# EAGLE design working (EAGLE 5.11)
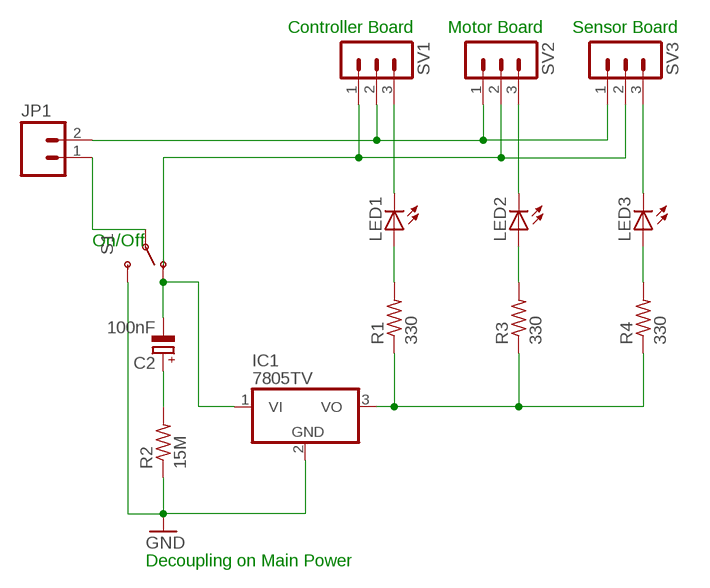
[diagram p0: schematic, sheet 1]

## Parts
C2  100nF  CPOL-EUE1.8-4  [E1,8-4]
IC1  7805TV  [TO220V]
JP1  M023.5MM_LOCK  [SCREWTERMINAL-3.5MM-2_LOCK]
LED1  LED5MM  [LED5MM]
LED2  LED5MM  [LED5MM]
LED3  LED5MM  [LED5MM]
R1  330  R-US_0204/5  [0204/5]
R2  15M  R-US_0204/5  [0204/5]
R3  330  R-US_0204/5  [0204/5]
R4  330  R-US_0204/5  [0204/5]
S1  SWITCH-SPSTPTH_LOCK  [SWITCH-SPDT_LOCK.007S]
SV1  MA03-1  [MA03-1]
SV2  MA03-1  [MA03-1]
SV3  MA03-1  [MA03-1]

## Nets
GND: IC1.2(GND) R2.1 S1.3(S)
N$1: JP1.2 SV1.2 SV2.1 SV3.1
N$2: C2.- IC1.1(VI) S1.1(O)
N$3: LED2.K(C) SV2.3
N$4: JP1.1 S1.2(P)
N$5: LED1.K(C) SV1.3
N$6: LED3.K(C) SV3.3
N$7: SV1.1 SV2.2 SV3.2
N$8: LED3.A R4.2
N$9: LED2.A R3.2
N$10: C2.+ R2.2
N$11: LED1.A R1.2
N$12: IC1.3(VO) R1.1 R3.1 R4.1

## Notes on the sheet
- Controller Board | Motor Board | Sensor Board
- On/Off
- Decoupling on Main Power

## Library data of the parts
C2 = rcl:CPOL-EU: POLARIZED CAPACITOR, European symbol
IC1 = linear:78*: Positive VOLTAGE REGULATOR Source: http://cache.national.com/ds/LM/LM78L05.pdf http://www.fairchildsemi.com/ds/LM/LM7805.pdf
JP1 = SparkFun:M02: Header 2 Standard 2-pin 0.1" header. Use with straight break away headers (SKU : PRT-00116), right angle break away headers (PRT-00553), swiss pins (PRT-00743), machine pins (PRT-00117), and female headers (PRT-00115). Molex polarized connector foot print use with SKU : PRT-08233 with associated crimp pins and housings.
LED1-LED3 = led:LED: LED OSRAM: - CHIPLED LG R971, LG N971, LY N971, LG Q971, LY Q971, LO R971, LY R971 LH N974, LH R974 LS Q976, LO Q976, LY Q976 LO Q996 - Hyper CHIPLED LW Q18S LB Q993, LB Q99A, LB R99A - SideLED LS A670, LO A670, LY A670, LG A670, LP A670 LB A673, LV A673, LT A673, LW A673 LH A674 LY A675 LS A676, LA A676, LO A676, LY A676, LW A676 LS A679, LY A679, LG A679 - Hyper Micro SIDELED® LS Y876, LA Y876, LO Y876, LY Y876 LT Y87S - SmartLED LW L88C, LW L88S LB L89C, LB L89S, LG L890 LS L89K, LO L89K, LY L89K LS L896, LA L896, LO L896, LY L896 - TOPLED LS T670, LO T670, LY T670, LG T670, LP T670 LSG T670, LSP T670, LSY T670, LOP T670, LYG T670 LG T671, LOG T671, LSG T671 LB T673, LV T673, LT T673, LW T673 LH T674 LS T676, LA T676, LO T676, LY T676, LB T676, LH T676, LSB T676, LW T676 LB T67C, LV T67C, LT T67C, LS T67K, LO T67K, LY T67K, LW E67C LS E67B, LA E67B, LO E67B, LY E67B, LB E67C, LV E67C, LT E67C LW T67C LS T679, LY T679, LG T679 LS T770, LO T770, LY T770, LG T770, LP T770 LB T773, LV T773, LT T773, LW T773 LH T774 LS E675, LA E675, LY E675, LS T675 LS T776, LA T776, LO T776, LY T776, LB T776 LHGB T686 LT T68C, LB T68C - Hyper Mini TOPLED® LB M676 - Mini TOPLED Santana® LG M470 LS M47K, LO M47K, LY M47K Source: http://www.osram.convergy.de LUXEON: - LUMILED® LXK2-PW12-R00, LXK2-PW12-S00, LXK2-PW14-U00, LXK2-PW14-V00 LXK2-PM12-R00, LXK2-PM12-S00, LXK2-PM14-U00 LXK2-PE12-Q00, LXK2-PE12-R00, LXK2-PE12-S00, LXK2-PE14-T00, LXK2-PE14-U00 LXK2-PB12-K00, LXK2-PB12-L00, LXK2-PB12-M00, LXK2-PB14-N00, LXK2-PB14-P00, LXK2-PB14-Q00 LXK2-PR12-L00, LXK2-PR12-M00, LXK2-PR14-Q00, LXK2-PR14-R00 LXK2-PD12-Q00, LXK2-PD12-R00, LXK2-PD12-S00 LXK2-PH12-R00, LXK2-PH12-S00 LXK2-PL12-P00, LXK2-PL12-Q00, LXK2-PL12-R00 Source: www.luxeon.com KINGBRIGHT: KA-3528ASYC Source: www.kingbright.com
R1-R4 = resistor:R-US_: RESISTOR, American symbol
S1 = SparkFun:SWITCH-SPST: SPST Switch Simple slide switch. Spark Fun Electronics SKU : COM-00102
SV1-SV3 = con-lstb:MA03-1: PIN HEADER; OC_FARNELL: unknown; OC_NEWARK: unknown

## Board
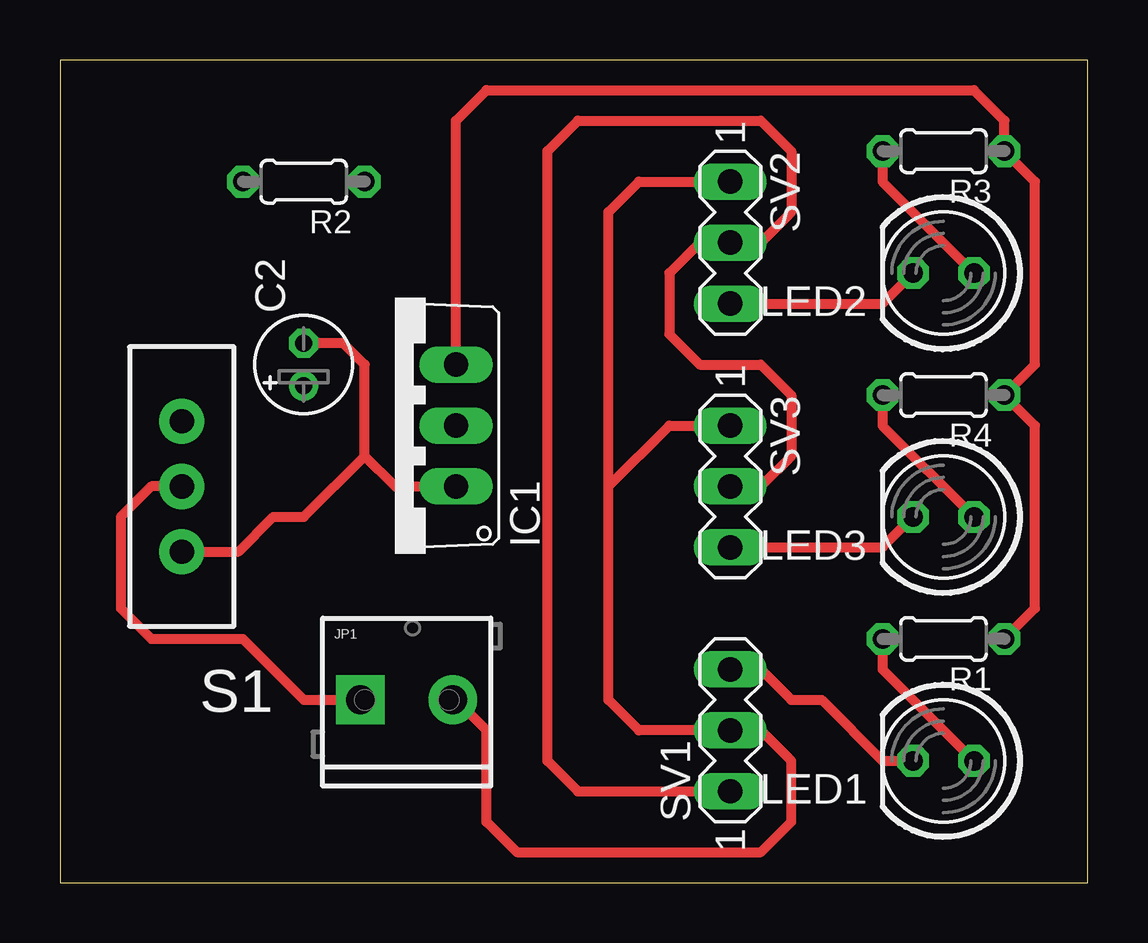
[diagram p1: board, top side]
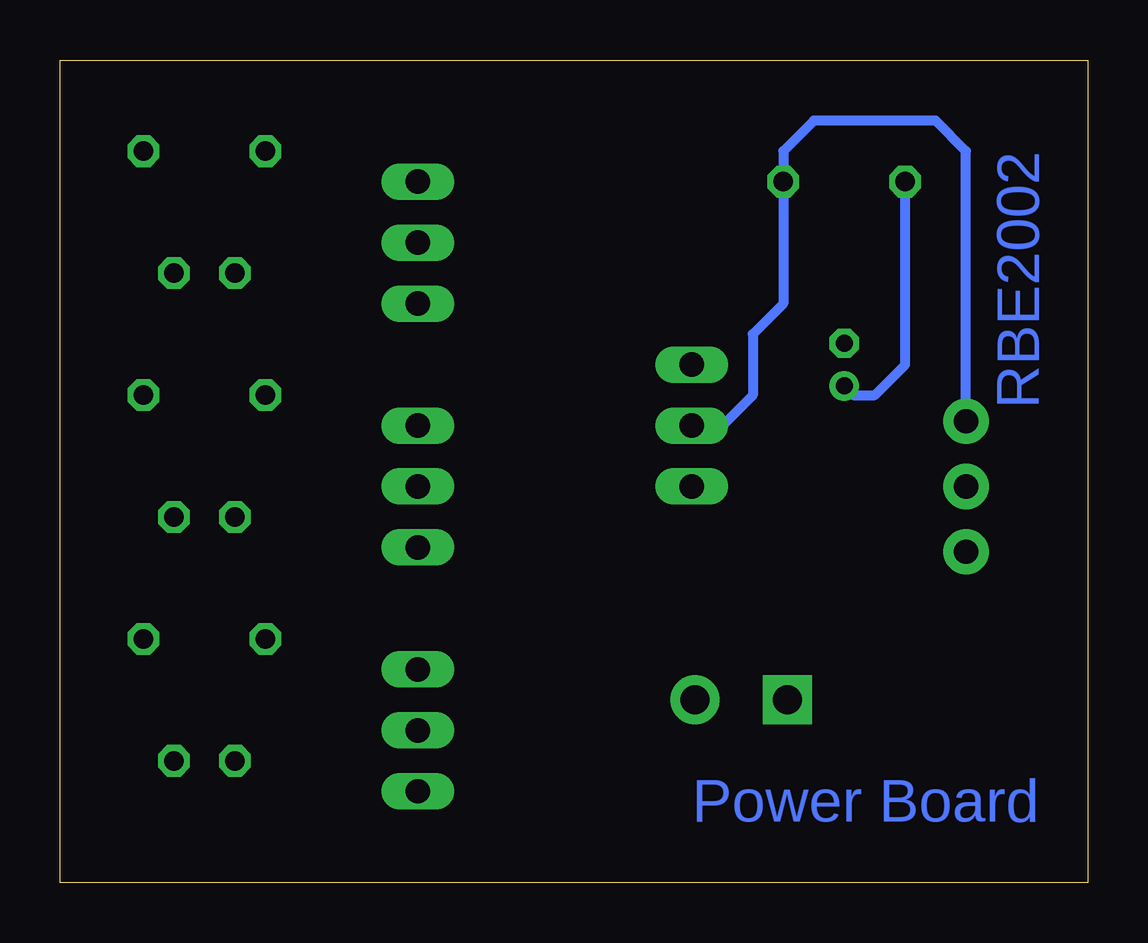
[diagram p2: board, bottom side, seen from below]

Size 42.85 x 34.28 mm. Coordinates in mm from the lower left corner, seen from the top.
Outline: 0,0 42.85,0 42.85,34.28 0,34.28 0,0
Copper layers (1*16): Top 0.035mm / dielectric 1.5mm / Bottom 0.035mm
Design rules "default": minimum track width 10mil, minimum drill 24mil, track to track 8mil, track to pad 8mil, pad to pad 8mil, via to via 8mil, smd to smd 8mil, copper to edge 40mil, drill to drill 8mil, minimum pad ring 10mil, minimum via ring 8mil, stop-mask expansion 4mil, vias tented up to drill 0mil, thermal gap 10mil

### Footprints (pad centres in the part's own frame; a part is rotated, then mirrored left to right if it is on the bottom)
E1,8-4 = drill 0.711 pad 1.168 round: + -0.889,0 | drill 0.711 pad 1.168 octagon: - 0.889,0
TO220V = drill 1.016 long: 1 -2.54,-2.54; 2 0,-2.54; 3 2.54,-2.54
SCREWTERMINAL-3.5MM-2_LOCK = drill 1.2 pad 2.032 square: 1 -0.178,0 | drill 1.2 pad 2.032 round: 2 3.678,0
LED5MM = drill 0.813 octagon: A -1.27,0; K 1.27,0
0204/5 = drill 0.813 octagon: 1 -2.54,0; 2 2.54,0
SWITCH-SPDT_LOCK.007S = drill 1.016 pad 1.88 round: 1 0,2.718; 2 0,0; 3 0,-2.718
MA03-1 = drill 1.016 long: 1 -2.54,0; 2 0,0; 3 2.54,0

### Placement (x,y rotation side)
C2  10.16,21.59 90 top
IC1  13.97,19.05 90 top
JP1  12.7,7.62 0 top
LED1  36.83,5.08 180 top
LED2  36.83,25.4 180 top
LED3  36.83,15.24 180 top
R1  36.83,10.16 180 top
R2  10.16,29.21 180 top
R3  36.83,30.48 180 top
R4  36.83,20.32 180 top
S1  5.08,16.51 180 top
SV1  27.94,6.35 90 top
SV2  27.94,26.67 270 top
SV3  27.94,16.51 270 top

### Tracks (layer width: path | path; a pad name or v marks a point on that pad's centre or on a via)
GND
  Bottom 0.406: S1.3 5.08,30.48 6.35,31.75 11.43,31.75 12.7,30.48 R2.1 12.7,24.13 13.97,22.86 13.97,20.32 15.24,19.05 IC1.2
N$1
  Top 0.406: SV2.1 24.13,29.21 22.86,27.94 22.86,16.51 | 22.86,16.51 22.86,7.62 24.13,6.35 SV1.2 29.21,6.35 30.48,5.08 30.48,2.54 29.21,1.27 19.05,1.27 17.78,2.54 17.78,6.35 16.51,7.62 JP1.2 | SV3.1 25.4,19.05 22.86,16.51
N$2
  Top 0.406: C2.- 11.81,22.48 12.7,21.59 12.7,17.78 | 12.7,17.78 13.97,16.51 IC1.1 | S1.1 7.44,13.79 8.89,15.24 10.16,15.24 12.7,17.78
N$3
  Top 0.406: SV2.3 34.29,24.13 LED2.K
N$4
  Top 0.406: S1.2 3.81,16.51 2.54,15.24 2.54,11.43 3.81,10.16 7.62,10.16 10.16,7.62 JP1.1 12.7,7.62
N$5
  Top 0.406: SV1.3 29.21,8.89 30.48,7.62 31.75,7.62 34.29,5.08 LED1.K
N$6
  Top 0.406: SV3.3 34.29,13.97 LED3.K
N$7
  Top 0.406: SV3.2 29.21,16.51 30.48,17.78 30.48,20.32 29.21,21.59 26.67,21.59 25.4,22.86 25.4,25.4 26.67,26.67 SV2.2 29.21,26.67 30.48,27.94 30.48,30.48 29.21,31.75 21.59,31.75 20.32,30.48 20.32,5.08 21.59,3.81 SV1.1
N$8
  Top 0.406: R4.2 34.29,19.05 LED3.A
N$9
  Top 0.406: R3.2 34.29,29.21 LED2.A
N$10
  Bottom 0.406: R2.2 7.62,21.59 8.89,20.32 9.78,20.32 C2.+
N$11
  Top 0.406: R1.2 34.29,8.89 LED1.A
N$12
  Top 0.406: IC1.3 16.51,31.75 17.78,33.02 38.1,33.02 39.37,31.75 R3.1 40.64,29.21 40.64,21.59 R4.1 40.64,19.05 40.64,11.43 R1.1

### Text on the board
Bottom: RBE2002 | Power Board